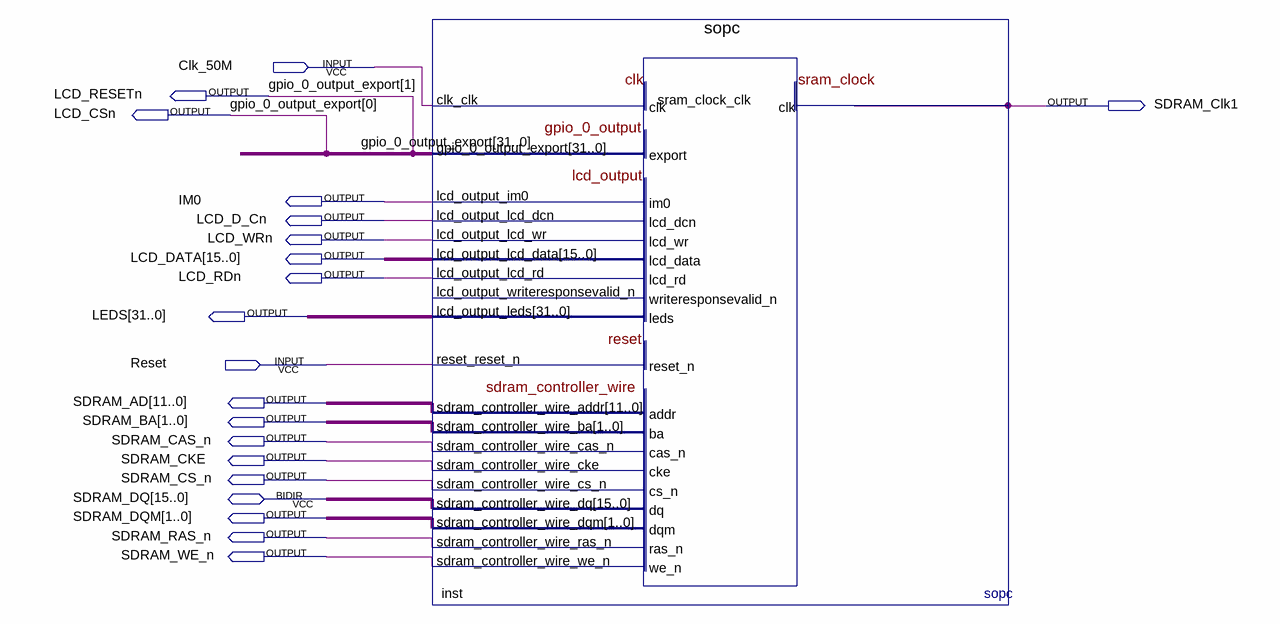
[diagram p0: schematic sheet]
// Quartus schematic TP01.bdf as structural Verilog: 1 symbols, 20 pins
module TP01 (
  input  Clk_50M,
  input  Reset,
  inout  [15:0] SDRAM_DQ,
  output LCD_RESETn,
  output SDRAM_Clk1,
  output LCD_CSn,
  output IM0,
  output LCD_D_Cn,
  output LCD_WRn,
  output [15:0] LCD_DATA,
  output LCD_RDn,
  output [31:0] LEDS,
  output [11:0] SDRAM_AD,
  output [1:0] SDRAM_BA,
  output SDRAM_CAS_n,
  output SDRAM_CKE,
  output SDRAM_CS_n,
  output [1:0] SDRAM_DQM,
  output SDRAM_RAS_n,
  output SDRAM_WE_n
);

  wire [31:2] gpio_0_output_export;

  sopc inst (
    .clk_clk(Clk_50M), .reset_reset_n(Reset), .lcd_output_im0(IM0), .lcd_output_lcd_dcn(LCD_D_Cn),
    .lcd_output_lcd_wr(LCD_WRn), .lcd_output_lcd_data(LCD_DATA), .lcd_output_lcd_rd(LCD_RDn),
    .lcd_output_leds(LEDS), .sdram_controller_wire_addr(SDRAM_AD), .sdram_controller_wire_ba(SDRAM_BA),
    .sdram_controller_wire_cas_n(SDRAM_CAS_n), .sdram_controller_wire_cke(SDRAM_CKE),
    .sdram_controller_wire_cs_n(SDRAM_CS_n), .sdram_controller_wire_dqm(SDRAM_DQM),
    .sdram_controller_wire_ras_n(SDRAM_RAS_n), .sdram_controller_wire_we_n(SDRAM_WE_n),
    .sram_clock_clk(SDRAM_Clk1), .gpio_0_output_export({gpio_0_output_export, LCD_RESETn, LCD_CSn}),
    .sdram_controller_wire_dq(SDRAM_DQ));  // open: lcd_output_writeresponsevalid_n

  // Other names for the same wires on the sheet: gpio_0_output_export[1:0] = {LCD_RESETn, LCD_CSn}
endmodule
